# Altium project PCB_Project.PrjPcb
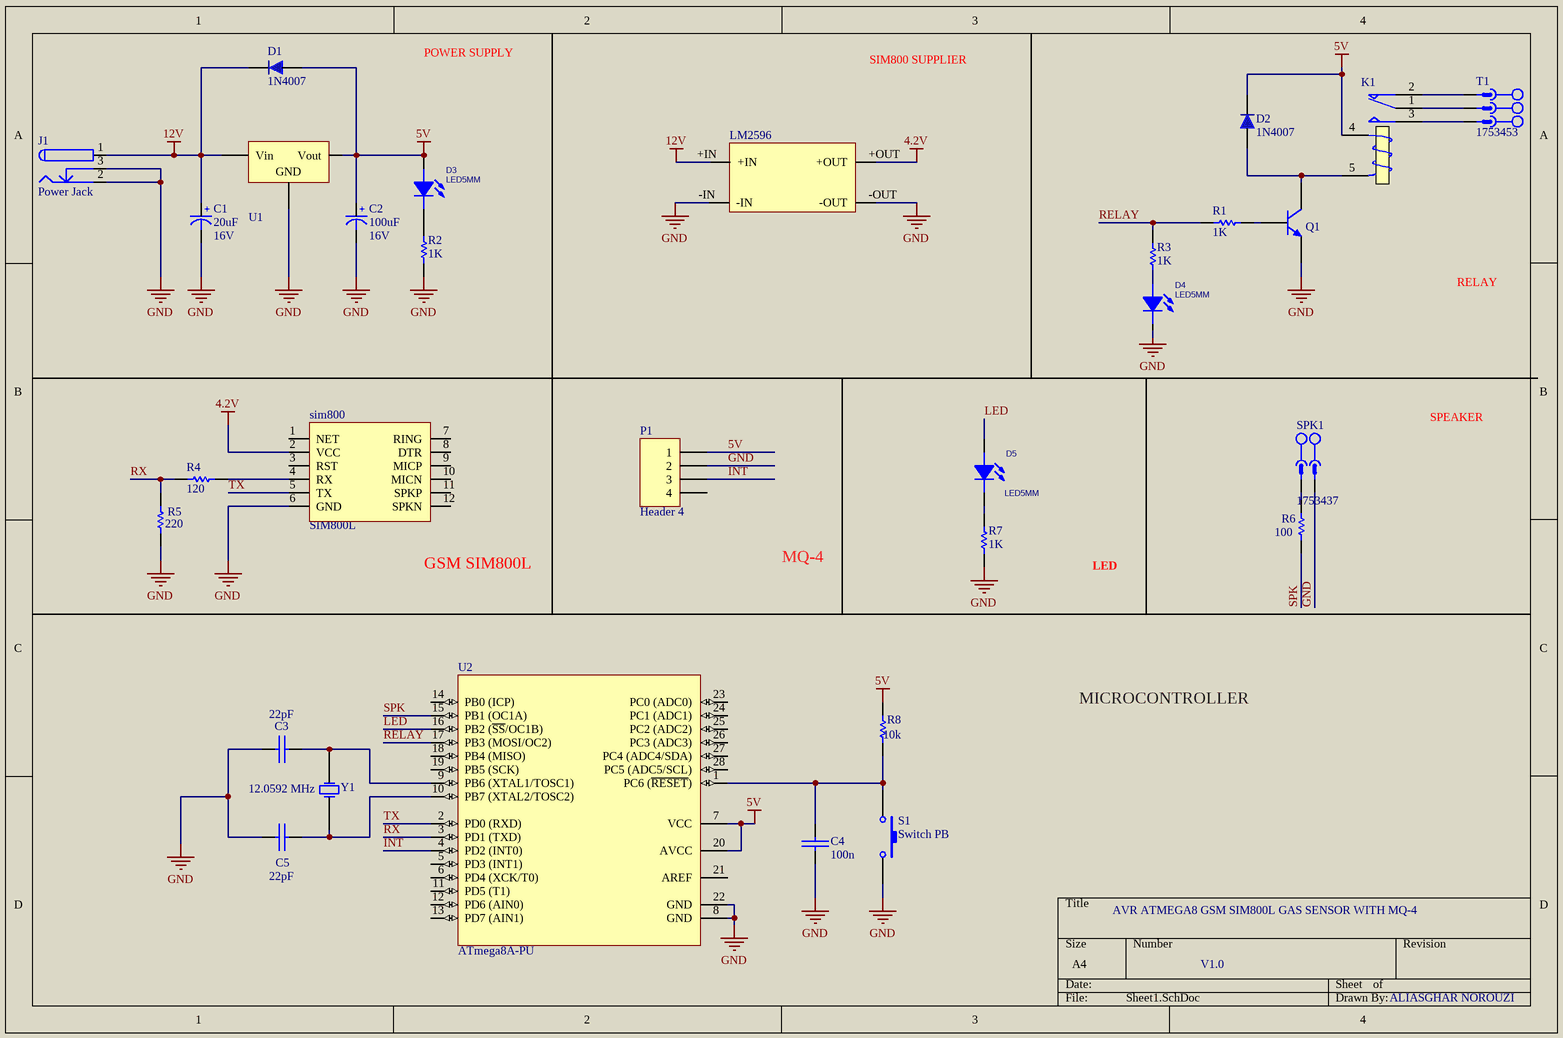
[diagram p0: Sheet1.SchDoc]
1 sheet, 30 parts. Net scope: global (net labels, ports and power ports of the same name join across sheets).
Board file: PCB1.PcbDoc

## Sheet Sheet1.SchDoc
size A4

### Parts
C1  Voltage: 16V  [cap 01]  (hidden comment: 20uF)
C2  Voltage: 16V  [cap 01]  (hidden comment: 100uF)
C3  22pF  [Cap - 100nF]
C4  100n  [Cap - 100nF]
C5  22pF  [Cap - 100nF]
D1  1N4007  [DO 35]
D2  1N4007  [DO 35]
D3  LED5MM  [LED5MM_YELLOW]
D4  LED5MM  [LED5MM_YELLOW]
D5  LED5MM  [LED5MM_BLUE]
J1  Power Jack  [Power Jack]
K1  (no value)  [Relay 18.85x15.35x15.70]
LM2596  LM2596  [LM2696]  (value not drawn)
P1  Header 4  [HDR1X4]
Q1  BC547  [TO-92 BENT]  (value not drawn)
R1  1K  [Axial 0_25 W, 0_4 IN LEAD PITCH]
R2  1K  [Axial 0_25 W, 0_4 IN LEAD PITCH]
R3  1K  [Axial 0_25 W, 0_4 IN LEAD PITCH]
R4  120  [Axial 0_25 W, 0_4 IN LEAD PITCH]
R5  220  [Axial 0_25 W, 0_4 IN LEAD PITCH]
R6  100  [Axial 0_25 W, 0_4 IN LEAD PITCH]
R7  1K  [Axial 0_25 W, 0_4 IN LEAD PITCH]
R8  10k  [Axial 0_25 W, 0_4 IN LEAD PITCH]
S1  Switch PB  [Switch - Push to On]
sim800  sim800l  [PCBComponent_1]
SPK1  1753437  [MSTBV 2,5/2-G-5]
T1  1753453  [MSTBV 2,5/3-G-5]
U1  L7805CV  [TO-220 AB]  (value not drawn)
U2  ATmega8A-PU  [28P3]
Y1  12.0592 MHz  [CRYSTAL Small]

### Nets
4.2V: LM2596.+OUT sim800.2(VCC)
5V: C2.1(+) D1.1 D2.2 D3.1(ANODE) K1.4(T1) P1.1 R8.2 U1.3(Vout) U2.7(VCC) U2.20(AVCC)
12V: C1.1(+) D1.2 J1.1 LM2596.+IN U1.1(Vin)
GND: C1.2(-) C2.2(-) C3.2(-) C4.2(-) C5.1(+) D4.2(CATHODE) J1.2 J1.3 LM2596.-IN LM2596.-OUT P1.2 Q1.3(E) R2.1 R5.2 R7.1 S1.2 sim800.6(GND) SPK1.2 U1.2(GND) U2.8(GND) U2.22(GND)
INT: P1.3 U2.4(PD2_(INT0))
LED: D5.1(ANODE) U2.16(PB2_(~{SS}/OC1B))
RELAY: R1.2 R3.2 U2.17(PB3_(MOSI/OC2))
RX: R4.1 R5.1 U2.3(PD1_(TXD))
SPK: R6.1 U2.15(PB1_(OC1A))
TX: sim800.5(TX) U2.2(PD0_(RXD))
NetC3_1: C3.1(+) U2.9(PB6_(XTAL1/TOSC1)) Y1.1(OSC1)
NetC4_1: C4.1(+) R8.1 S1.1 U2.1(PC6_(~{RESET}))
NetC5_2: C5.2(-) U2.10(PB7_(XTAL2/TOSC2)) Y1.2(OSC2)
NetD2_1: D2.1 K1.5(T2) Q1.1(C)
NetD3_2: D3.2(CATHODE) R2.2
NetD4_1: D4.1(ANODE) R3.1
NetD5_2: D5.2(CATHODE) R7.2
NetK1_1: K1.1(COM) T1.2
NetK1_2: K1.2(NC) T1.1
NetK1_3: K1.3(NO) T1.3
NetQ1_2: Q1.2(B) R1.1
NetR4_2: R4.2 sim800.4(RX)
NetR6_2: R6.2 SPK1.1

Not connected (* = marked no-connect by the designer): P1 4; sim800 1(NET) 3(RST) 7(RING) 8(DTR) 9(MICP) 10(MICN) 11(SPKP) 12(SPKN); U2 5(PD3_(INT1)) 6(PD4_(XCK/T0)) 11(PD5_(T1)) 12(PD6_(AIN0)) 13(PD7_(AIN1)) 14(PB0_(ICP)) 18(PB4_(MISO)) 19(PB5_(SCK)) 21(AREF) 23(PC0_(ADC0)) 24(PC1_(ADC1)) 25(PC2_(ADC2)) 26(PC3_(ADC3)) 27(PC4_(ADC4/SDA)) 28(PC5_(ADC5/SCL))

### Notes on the sheet
- POWER SUPPLY
- SIM800 SUPPLIER
- RELAY
- SPEAKER
- (near sim800) GSM SIM800L
- MQ-4
- LED
- MICROCONTROLLER
- AVR ATMEGA8 GSM SIM800L GAS SENSOR WITH MQ-4
- V1.0
- ALIASGHAR NOROUZI

### Library data of the parts
C1 C2 = Cap-Polar: Polar Capacitor; Designer: Saeid Jorablo; Organazation: ControTec; Adding Date: 1387/12/20
  C1: Value: 20uF
  C2: Value: 100uF
C3-C5 = Cap-Bipolar: Bipolar Capacitor; Voltage: 100V; Designer: Saeid Jorablo; Organazation: ControTec; Adding Date: 1387/12/20
  C3 C5: Value: 22pF
  C4: Value: 100n
D1 D2 = 1N4148: DIODE GEN PURP 100V 200MA DO35; Published: 2017-1-12; PackageVersion: 2017-1-12; PackageReference: DO 35; Publisher: Abbas Basereh; PackageDescription: DIODE GEN PURP 100V 200MA DO35; ComponentLink1Description: Manufacturer Link; ComponentLink1URL: http://www.digikey.com/product-detail/en/fairchild-on-semiconductor/1N4148/1N4148FS-ND/458603; ComponentLink2Description: Datasheet; PART.NO: 1N4148
D3-D5 = LED5MM: LED LIGHTING; Designer: Abbas Basereh; Data: 16-12-2016; Link: *; Part.No: *
J1 = Power Jack: Designer: Saeid Jorablo; Company: Personal; Project Name: Laser; Adding Date: 10/21/2009
K1 = Relay_SPDT: Single-Pole Dual-Throw Relay; Designer: Abbas Basereh; Mounting Technology: Through-Hole; ComponentLink1Description: Datasheet; Pin Count: 0; Update Date: 2017-3-1
P1 = Header 4: Header, 4-Pin; LatestRevisionDate: 17-Jul-2002; LatestRevisionNote: Re-released for DXP Platform.; Publisher: Altium Limited
Q1 = BC547: NPN Transistor; Designer: Abbas Basereh; Desc.: Plastic Medium-Power. Silicon NPN Transistors; Data: 27-12-2016
R1-R8 = RES Axial 0.25W: Designer: Abbas Basereh; Desc.: RES Axial 0.25W; Data: 4-1-2017
S1 = Switch PB: Push Button Switch
SPK1 = CON_Phoenix_MSTBV_02: 2 Pitch: 5 mm Color: green Contact surface: Tin Assembly; Manufacturer: PHOENIX CONTACT; Connector type: PCB Terminal Block; designer: ABBAS BASEREH; Max Current: 12 A; Positions: 2; Voltage: 320 V; Category: Connector; ComponentLink1Description: Header, Nominal current: 12 A Rated voltage (III/2): 320 V Number of positions: 2 Pitch: 5 mm Color: green Contact surface: Tin Assembly: Soldering  DESIGNER:ABBAS BASEREH; ComponentLink2Description: Reference; Mounting Technology: Through-Hole; Pin Count: 2; Revision 1: 2017-3-1; Status: Unreleased; PART.NO: 1753437
T1 = CON_Phoenix_MSTBV_03: 3 Pitch: 5 mm Color: green Contact surface: Tin Assembly; Manufacturer: PHOENIX CONTACT; Connector type: PCB Terminal Block; designer: ABBAS BASEREH; Max Current: 12 A; Positions: 3; Voltage: 320 V; Category: Connector; ComponentLink1Description: Header, Nominal current: 12 A Rated voltage (III/2): 320 V Number of positions: 3 Pitch: 5 mm Color: green Contact surface: Tin Assembly: Soldering  DESIGNER:ABBAS BASEREH; ComponentLink2Description: Reference; Mounting Technology: Through-Hole; Pin Count: 3; Revision 1: 2017-3-1; Status: Unreleased; PART.NO: 1753453
U1 = L7805CV-Linear Voltage Regulator IC Positive 1 Output 5V 1.5A TO-220AB: Linear Voltage Regulator IC Positive FIXED; Manufacturer: STMicroelectronics; Designer: Abbas Basereh; Link: https://www.aliexpress.com/item/; Link: http://www.tme.eu/en/; Link: http://www.digikey.com/; Part. No: L7805CV
U2 = ATmega8A-PU: 8-bit AVR Microcontroller, 8KB Flash, 512 Bytes EEPROM, 1KB SRAM, 28-pin PDIP, Industrial Grade (-40°C to 85°C); Published: 2017-1-5; DatasheetVersion: 2017-1-5; PackageVersion: 2017-1-5; PackageReference: 28P3; Publisher: Abbas Basereh; PackageDescription: 28-lead (0.300"/7.62mm Wide) Plastic Dual Inline Package (PDIP); Supplier 1: Digi-Key; Supplier Part Number 1: ATMEGA8A-PU-ND; Supplier 2: Farnell; Supplier Part Number 2: 1748534; Supplier 3: Mouser; Supplier Part Number 3: 556-ATMEGA8A-PU; ComponentLink1Description: Manufacturer Link; ComponentLink1URL: http://www.atmel.com/products/avr/default.asp?; ComponentLink2Description: ATmega8A Datasheet; ComponentLink2URL: http://www.atmel.com/dyn/resources/prod_documents/doc8159.pdf; ComponentLink3Description: ATmega8A Summary; ComponentLink3URL: http://www.atmel.com/dyn/resources/prod_documents/8159S.pdf; ComponentLink4Description: Atmel.com Home; ComponentLink4URL: http://www.atmel.com
Y1 = XTAL_Crystal: XTAL Crystal; Designer: ABBAS BASEREH; Design Date: 2017-1-3; ComponentLink1Description: Datasheet; ComponentLink2Description: Reference; Mounting Technology: Surface Mount\Through-Hole; Value: 12.0592 MHz; Status: Unreleased
sim800 = sim800l: name: SIM800L